# Altium project BTB.PrjPcb
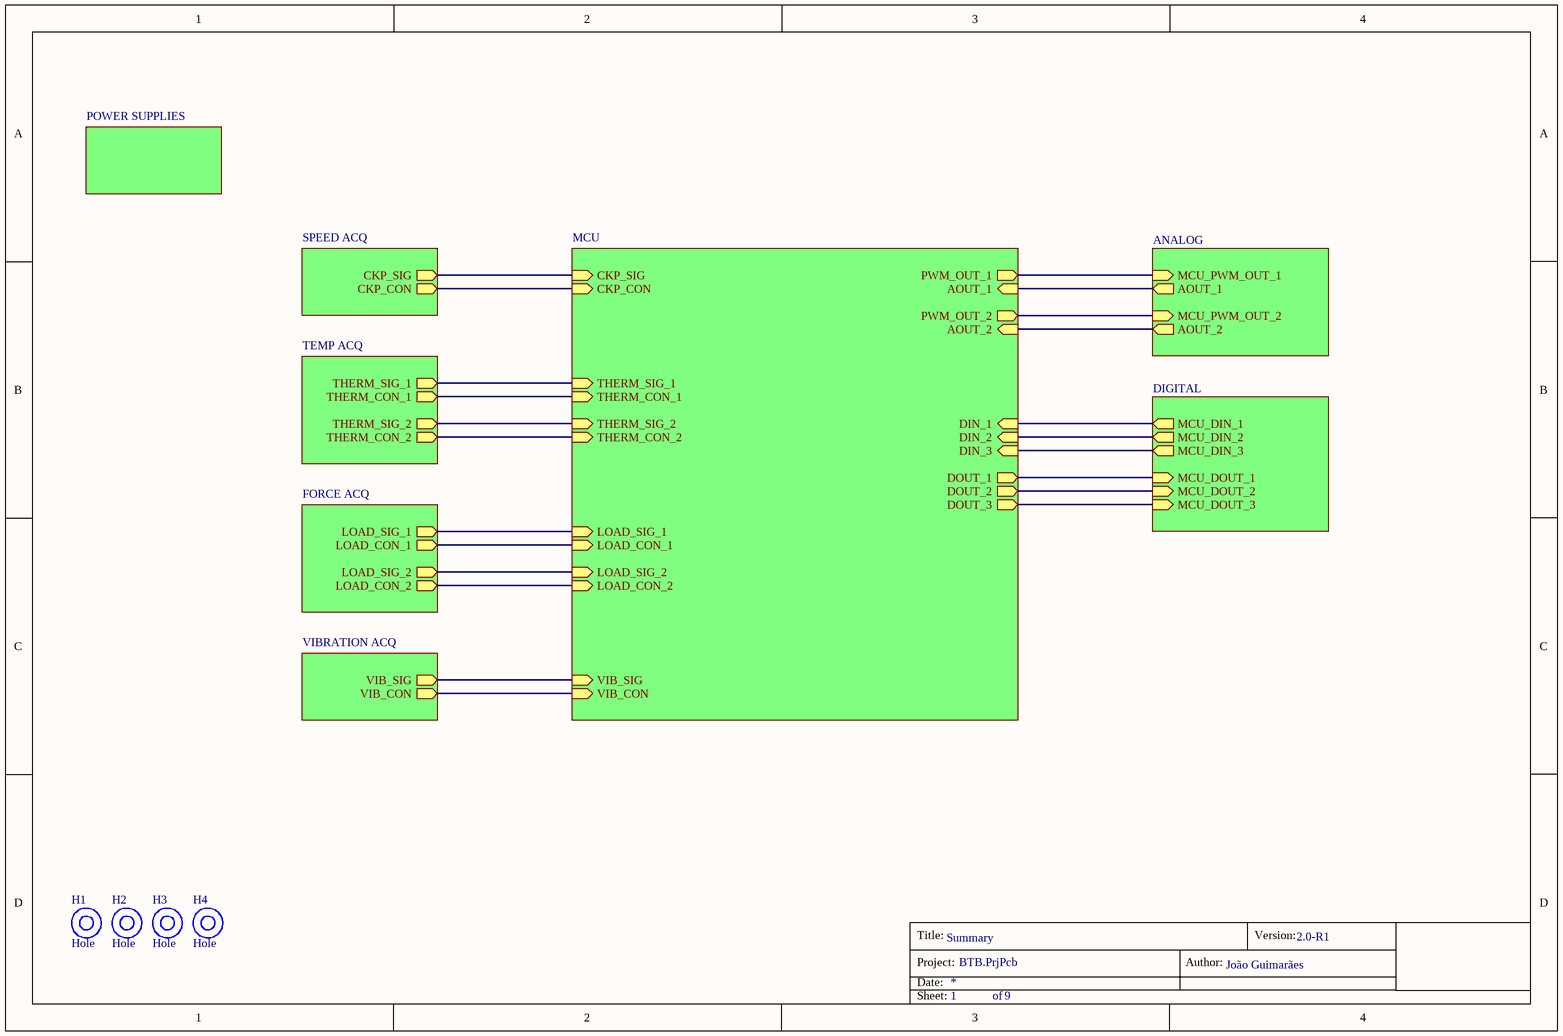
[diagram p0: Summary.SchDoc]
Version: 2.0-R1
9 sheets, 309 parts. Net scope: hierarchical (ports join the sheet entries above them; power ports are global).
Board file: PCB.PcbDoc
Sheets:
  Summary.SchDoc
    SPEED ACQ = SpeedACQ.SchDoc
    MCU = MCU.SchDoc
    TEMP ACQ = TemperatureACQ.SchDoc
    FORCE ACQ = ForceACQ.SchDoc
    VIBRATION ACQ = VibrationACQ.SchDoc
    ANALOG = AnalogOutput.SchDoc
    DIGITAL = DigitalInterfaces.SchDoc
    POWER SUPPLIES = PowerSupplies.SchDoc

## Sheet Summary.SchDoc: Summary
size A4; Author: João Guimarães; Revision: 2.0; SheetNumber: 1; SheetTotal: 9

### Parts
H1  Hole  [MISC-HOLE-3.5MM/6.6MM]
H2  Hole  [MISC-HOLE-3.5MM/6.6MM]
H3  Hole  [MISC-HOLE-3.5MM/6.6MM]
H4  Hole  [MISC-HOLE-3.5MM/6.6MM]

### Sub-sheets
ANALOG = AnalogOutput.SchDoc: MCU_PWM_OUT_1 (in), AOUT_1 (out), MCU_PWM_OUT_2 (in), AOUT_2 (out)
DIGITAL = DigitalInterfaces.SchDoc: MCU_DIN_1 (out), MCU_DIN_2 (out), MCU_DIN_3 (out), MCU_DOUT_1 (in), MCU_DOUT_2 (in), MCU_DOUT_3 (in)
FORCE ACQ = ForceACQ.SchDoc: LOAD_SIG_1 (out), LOAD_CON_1 (out), LOAD_SIG_2 (out), LOAD_CON_2 (out)
MCU = MCU.SchDoc: CKP_SIG (in), CKP_CON (in), THERM_SIG_1 (in), THERM_CON_1 (in), THERM_SIG_2 (in), THERM_CON_2 (in), LOAD_SIG_1 (in), LOAD_CON_1 (in), LOAD_SIG_2 (in), LOAD_CON_2 (in), VIB_SIG (in), VIB_CON (in), DIN_1 (in), DIN_2 (in), DIN_3 (in), DOUT_1 (out), DOUT_2 (out), DOUT_3 (out), PWM_OUT_1 (out), AOUT_1 (in), AOUT_2 (in), PWM_OUT_2 (out)
POWER SUPPLIES = PowerSupplies.SchDoc: no entries
SPEED ACQ = SpeedACQ.SchDoc: CKP_SIG (out), CKP_CON (out)
TEMP ACQ = TemperatureACQ.SchDoc: THERM_SIG_1 (out), THERM_CON_1 (out), THERM_SIG_2 (out), THERM_CON_2 (out)
VIBRATION ACQ = VibrationACQ.SchDoc: VIB_SIG (out), VIB_CON (out)

### Nets
ANALOG_OUT_1: sheet MCU/AOUT_1, sheet ANALOG/AOUT_1
ANALOG_OUT_2: sheet MCU/AOUT_2, sheet ANALOG/AOUT_2
LOAD_CON_1: sheet MCU/LOAD_CON_1, sheet FORCE ACQ/LOAD_CON_1
LOAD_CON_2: sheet MCU/LOAD_CON_2, sheet FORCE ACQ/LOAD_CON_2
LOAD_SIG_1: sheet MCU/LOAD_SIG_1, sheet FORCE ACQ/LOAD_SIG_1
LOAD_SIG_2: sheet MCU/LOAD_SIG_2, sheet FORCE ACQ/LOAD_SIG_2
MISO: sheet MCU/DIN_2, sheet DIGITAL/MCU_DIN_2
MOSI: sheet MCU/DIN_3, sheet DIGITAL/MCU_DIN_3
THERM_CON_1: sheet MCU/THERM_CON_1, sheet TEMP ACQ/THERM_CON_1
THERM_CON_2: sheet MCU/THERM_CON_2, sheet TEMP ACQ/THERM_CON_2
THERM_SIG_1: sheet MCU/THERM_SIG_1, sheet TEMP ACQ/THERM_SIG_1
THERM_SIG_2: sheet MCU/THERM_SIG_2, sheet TEMP ACQ/THERM_SIG_2
NetC43_2: sheet SPEED ACQ/CKP_SIG, sheet MCU/CKP_SIG
NetP22_2: sheet MCU/VIB_SIG, sheet VIBRATION ACQ/VIB_SIG
NetQ4_2: sheet MCU/DIN_1, sheet DIGITAL/MCU_DIN_1
NetQ18_2: sheet SPEED ACQ/CKP_CON, sheet MCU/CKP_CON
NetQ21_2: sheet MCU/VIB_CON, sheet VIBRATION ACQ/VIB_CON
NetR2_2: sheet MCU/PWM_OUT_1, sheet ANALOG/MCU_PWM_OUT_1
NetR8_2: sheet MCU/PWM_OUT_2, sheet ANALOG/MCU_PWM_OUT_2
NetR17_2: sheet MCU/DOUT_1, sheet DIGITAL/MCU_DOUT_1
NetR18_2: sheet MCU/DOUT_2, sheet DIGITAL/MCU_DOUT_2
NetR19_2: sheet MCU/DOUT_3, sheet DIGITAL/MCU_DOUT_3

### Notes on the sheet
- Title:
- Project:
- Date:
- Author:
- Version:
- Sheet:
- of

## Sheet SpeedACQ.SchDoc: SpeedACQ
size A4; Author: João Guimarães; Organization: Altium Limited; Address1: L3, 12a Rodborough Rd; Address2: Frenchs Forest; Address3: NSW; Address4: Australia 2086; Revision: 2.0; SheetNumber: 4; SheetTotal: 9
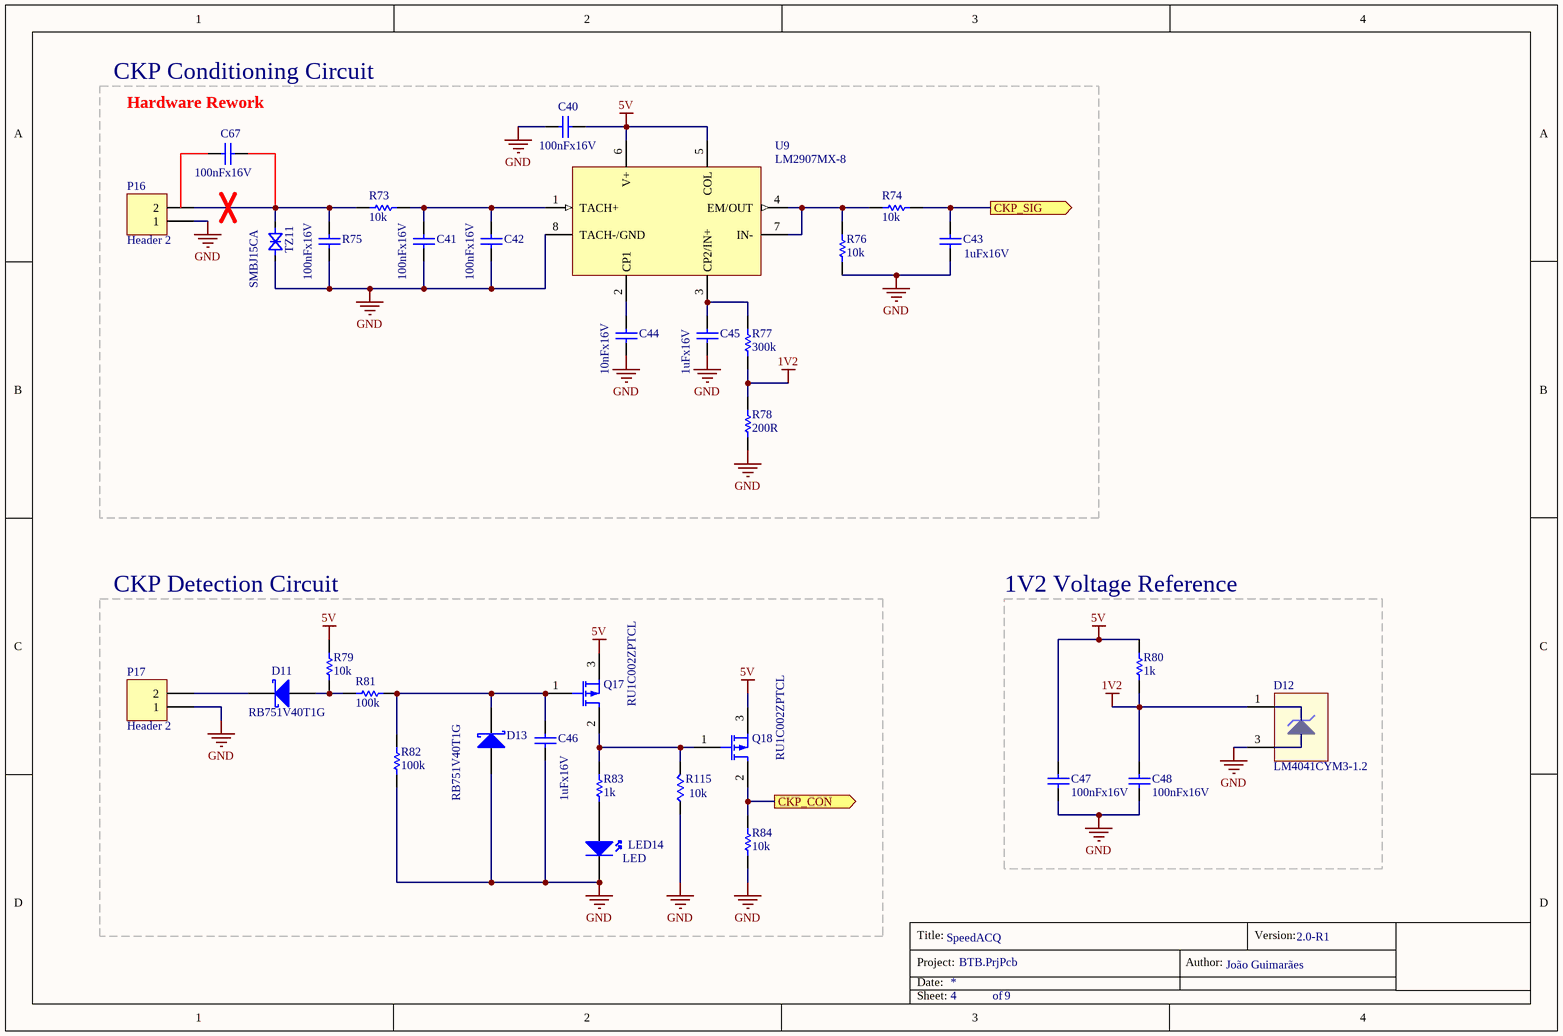
[diagram p1: SpeedACQ.SchDoc]

### Parts
C40  100nFx16V  [DISC-0805]
C41  100nFx16V  [DISC-0805]
C42  100nFx16V  [DISC-0805]
C43  1uFx16V  [DISC-0805]
C44  10nFx16V  [DISC-0805]
C45  1uFx16V  [DISC-0805]
C46  1uFx16V  [DISC-0805]
C47  100nFx16V  [DISC-0805]
C48  100nFx16V  [DISC-0805]
C67  100nFx16V  [DISC-0805]
D11  RB751V40T1G  [DISC-SOD-323]
D12  LM4041CYM3-1.2  [DISC-SOT-23]
D13  RB751V40T1G  [DISC-SOD-323]
LED14  LED  [DISC-LED-0.1-PTH]
P16  Header 2  [CON-FLEXWIRE-0.5MM2-1X2]
P17  Header 2  [CON-FLEXWIRE-0.5MM2-1X2]
Q17  RU1C002ZPTCL  [DISC-SOT-23]
Q18  RU1C002ZPTCL  [DISC-SOT-23]
R73  10k  [DISC-0805]
R74  10k  [DISC-0805]
R75  100nFx16V  [DISC-0805]
R76  10k  [DISC-0805]
R77  300k  [DISC-0805]
R78  200R  [DISC-0805]
R79  10k  [DISC-0805]
R80  1k  [DISC-0805]
R81  100k  [DISC-0805]
R82  100k  [DISC-0805]
R83  1k  [DISC-0805]
R84  10k  [DISC-0805]
R115  10k  [DISC-0805]
TZ11  SMBJ15CA  [DISC-DO214-AA]
U9  LM2907MX-8  [CI-SOIC-8]

### Blocks framed on the sheet
CKP Conditioning Circuit: C40-C45 C67 P16 R73-R78 TZ11 U9
CKP Detection Circuit: C46 D11 D13 LED14 P17 Q17 Q18 R79 R81-R84 R115
1V2 Voltage Reference: C47 C48 D12 R80

### Ports
CKP_CON (out), CKP_SIG (out)

### Nets
1V2: C48.1 D12.1(A) R77.2 R78.1 R80.2
5V: C40.1 C47.1 Q17.3(S) Q18.3(S) R79.1 R80.1 U9.5(COL) U9.6(V+)
GND: C40.2 C41.1 C42.1 C43.1 C44.1 C45.1 C46.1 C47.2 C48.2 D12.3(K) D13.1(A) LED14.2(K) P16.1 P17.1 R75.1 R76.2 R78.2 R82.1 R84.2 R115.1 TZ11.1(A) U9.8(TACH-/GND)
NetC41_2: C41.2 C42.2 R73.1 U9.1(TACH+)
NetC43_2: C43.2 R74.2 ; port CKP_SIG
NetC44_2: C44.2 U9.2(CP1)
NetC45_2: C45.2 R77.1 U9.3(CP2/IN+)
NetC46_2: C46.2 D13.2(K) Q17.1(G) R81.1 R82.2
NetC67_2: C67.2 P16.2 R73.2 R75.2 TZ11.2(K)
NetD11_1: D11.1(A) R79.2 R81.2
NetD11_2: D11.2(K) P17.2
NetLED14_1: LED14.1(A) R83.1
NetQ17_2: Q17.2(D) Q18.1(G) R83.2 R115.2
NetQ18_2: Q18.2(D) R84.1 ; port CKP_CON
NetR74_1: R74.1 R76.1 U9.4(EM/OUT) U9.7(IN-)

Not connected (* = marked no-connect by the designer): C67 1; D12 2

### Notes on the sheet
- (near C67) Hardware Rework
- Title:
- Project:
- Date:
- Author:
- Version:
- Sheet:
- of

### Library data of the parts
C40-C48 C67 R75 = Cap: Capacitor
D11 D13 = D Schottky: Schottky Diode; Published: 8-Jun-2000; LatestRevisionDate: 17-Jul-2002; LatestRevisionNote: Re-released for DXP Platform.; PackageReference: SMB; Publisher: Altium Limited; PackageDescription: DO-214-AA/SMB; 2 C-Bend Leads; Body 5.3 x 3.6 mm, inc. leads (LxW); Code_JEDEC: DO-214-AA
D12 = LM4040: Shunt Voltage References
P16 P17 = Header 2: Header, 2-Pin; LatestRevisionDate: 17-Jul-2002; LatestRevisionNote: Re-released for DXP Platform.; Publisher: Altium Limited
Q17 Q18 = Transistor-PMOS: P-Channel MOSFET
R73 R74 R76-R84 = Res: Resistor
R115 = RESISTOR: PartNumber1: *; Manufacturer1: *; ClassName: *; Price: *; PriceType: FOB
TZ11 = TVZ-Bi-Directional
U9 = LM2907MX-8: Voltage to Frequency & Frequency to Voltage Frequency to Voltage Converter

## Sheet MCU.SchDoc: MCU
size A4; Author: João Guimarães; Revision: 2.0; SheetNumber: 3; SheetTotal: 9
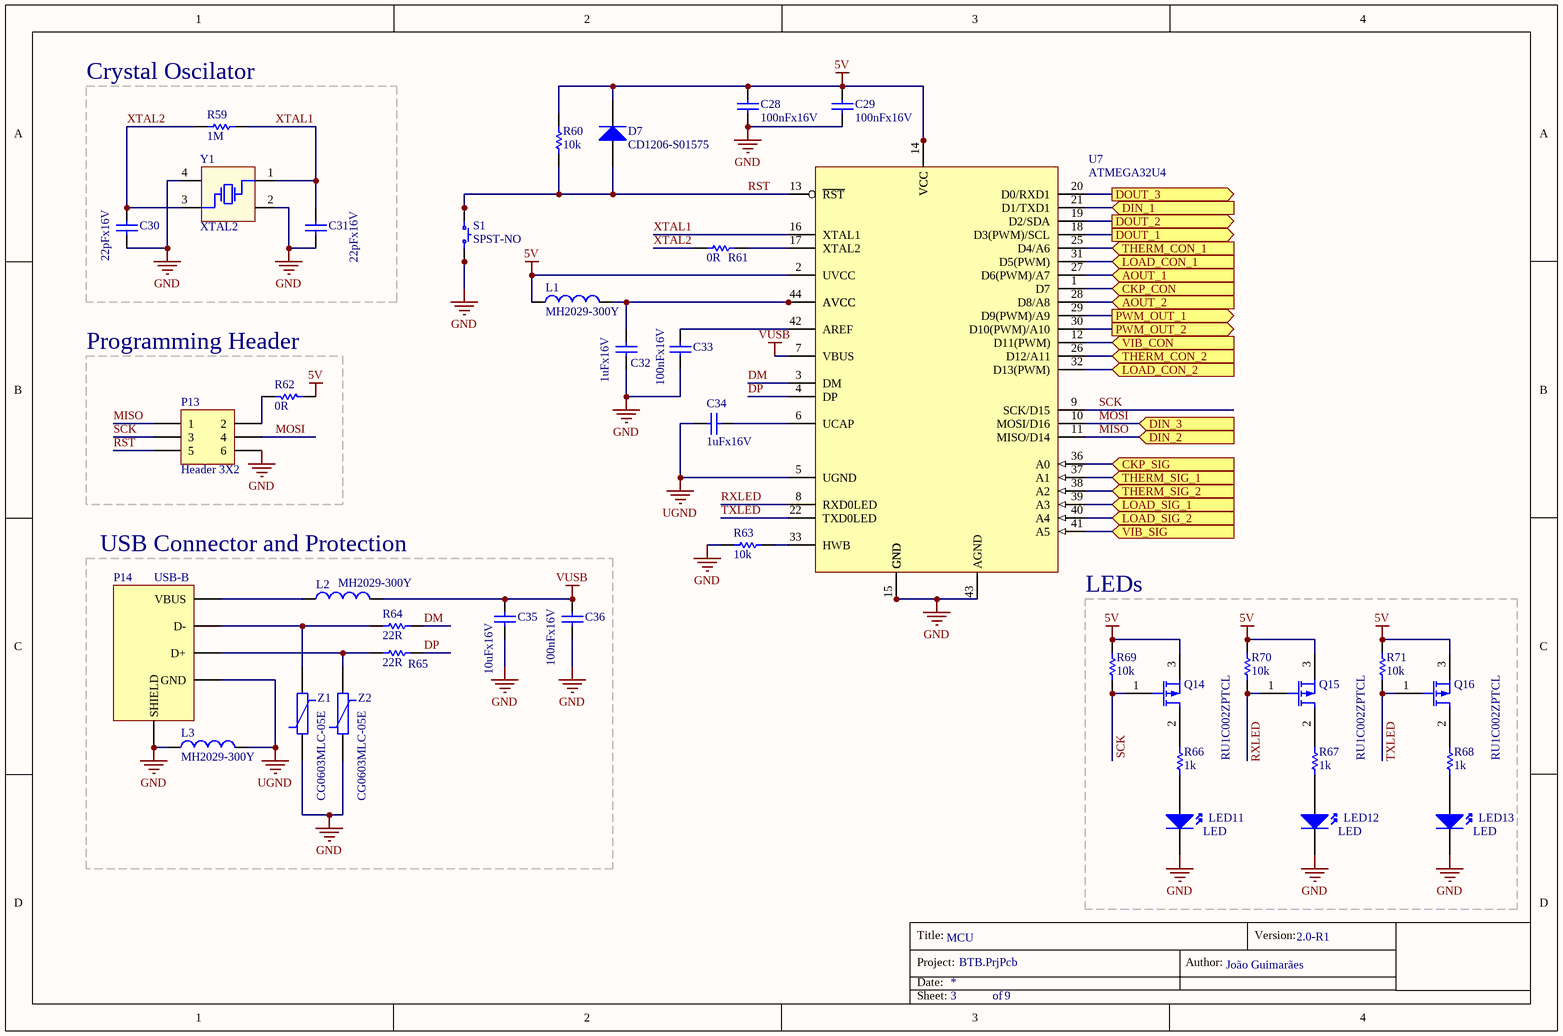
[diagram p2: MCU.SchDoc]

### Parts
C28  100nFx16V  [DISC-0805]
C29  100nFx16V  [DISC-0805]
C30  22pFx16V  [DISC-0805]
C31  22pFx16V  [DISC-0805]
C32  1uFx16V  [DISC-0805]
C33  100nFx16V  [DISC-0805]
C34  1uFx16V  [DISC-0805]
C35  10uFx16V  [DISC-0805]
C36  100nFx16V  [DISC-0805]
D7  CD1206-S01575  [DISC-1206]
L1  MH2029-300Y  [DISC-0805]
L2  MH2029-300Y  [DISC-0805]
L3  MH2029-300Y  [DISC-0805]
LED11  LED  [DISC-LED-0.1-PTH]
LED12  LED  [DISC-LED-0.1-PTH]
LED13  LED  [DISC-LED-0.1-PTH]
P13  Header 3X2  [CON-HEADER-2X3-PTH]
P14  USB-B  [CON-USB-B]
Q14  RU1C002ZPTCL  [DISC-SOT-23]
Q15  RU1C002ZPTCL  [DISC-SOT-23]
Q16  RU1C002ZPTCL  [DISC-SOT-23]
R59  1M  [DISC-0805]
R60  10k  [DISC-0805]
R61  0R  [DISC-0805]
R62  0R  [DISC-0805]
R63  10k  [DISC-0805]
R64  22R  [DISC-0805]
R65  22R  [DISC-0805]
R66  1k  [DISC-0805]
R67  1k  [DISC-0805]
R68  1k  [DISC-0805]
R69  10k  [DISC-0805]
R70  10k  [DISC-0805]
R71  10k  [DISC-0805]
S1  SPST-NO  [DISC-PUSHBUTTON-4P-SMD]
U7  ATMEGA32U4  [CI-QFP-44]
Y1  XTAL2  [DISC-CRYSTAL-4P-3.2X2.5]
Z1  CG0603MLC-05E  [DISC-0603]
Z2  CG0603MLC-05E  [DISC-0603]

### Blocks framed on the sheet
Crystal Oscilator: C30 C31 R59 Y1
Programming Header: P13 R62
USB Connector and Protection: C35 C36 L2 L3 P14 R64 R65 Z1 Z2
LEDs: LED11-LED13 Q14-Q16 R66-R71

### Ports
AOUT_1 (in), AOUT_2 (in), CKP_CON (in), CKP_SIG (in), DIN_1 (in), DIN_2 (in), DIN_3 (in), DOUT_1 (out), DOUT_2 (out), DOUT_3 (out), LOAD_CON_1 (in), LOAD_CON_2 (in), LOAD_SIG_1 (in), LOAD_SIG_2 (in), PWM_OUT_1 (out), PWM_OUT_2 (out), THERM_CON_1 (in), THERM_CON_2 (in), THERM_SIG_1 (in), THERM_SIG_2 (in), VIB_CON (in), VIB_SIG (in)

### Nets
5V: C28.1 C29.1 D7.2(K) L1.1 Q14.3(S) Q15.3(S) Q16.3(S) R60.1 R62.2 R69.1 R70.1 R71.1 U7.2(UVCC) U7.14(VCC) U7.34(VCC)
GND: C28.2 C29.2 C30.1 C31.1 C32.2 C33.2 C35.2 C36.2 L3.1 LED11.2(K) LED12.2(K) LED13.2(K) P13.6 P14.5(SHIELD) P14.6(SHIELD) R63.1 S1.1 S1.2 U7.15(GND) U7.23(GND) U7.35(GND) U7.43(AGND) Y1.2(GND) Y1.4(GND) Z1.1 Z2.1
UGND: C34.1 L3.2 P14.4(GND) U7.5(UGND)
VUSB: C35.1 C36.1 L2.2 U7.7(VBUS)
ANALOG_OUT_1: U7.27(D6(PWM)/A7) ; port AOUT_1
ANALOG_OUT_2: U7.28(D8/A8) ; port AOUT_2
DM: R64.2 U7.3(DM)
DP: R65.2 U7.4(DP)
LOAD_CON_1: U7.31(D5(PWM)) ; port LOAD_CON_1
LOAD_CON_2: U7.32(D13(PWM)) ; port LOAD_CON_2
LOAD_SIG_1: U7.39(A3) ; port LOAD_SIG_1
LOAD_SIG_2: U7.40(A4) ; port LOAD_SIG_2
MISO: P13.1 U7.11(MISO/D14) ; port DIN_2
MOSI: P13.4 U7.10(MOSI/D16) ; port DIN_3
RST: D7.1(A) P13.5 R60.2 S1.3 S1.4 U7.13(~{RST})
RXLED: Q15.1(G) R70.2 U7.8(RXD0LED)
SCK: P13.3 Q14.1(G) R69.2 U7.9(SCK/D15)
THERM_CON_1: U7.25(D4/A6) ; port THERM_CON_1
THERM_CON_2: U7.26(D12/A11) ; port THERM_CON_2
THERM_SIG_1: U7.37(A1) ; port THERM_SIG_1
THERM_SIG_2: U7.38(A2) ; port THERM_SIG_2
TXLED: Q16.1(G) R71.2 U7.22(TXD0LED)
XTAL1: C31.2 R59.2 U7.16(XTAL1) Y1.1(OSC1)
XTAL2: C30.2 R59.1 R61.1 Y1.3(OSC2)
NetC32_1: C32.1 L1.2 U7.24(AVCC) U7.44(AVCC)
NetC33_1: C33.1 U7.42(AREF)
NetC34_2: C34.2 U7.6(UCAP)
NetC43_2: U7.36(A0) ; port CKP_SIG
NetL2_1: L2.1 P14.1(VBUS)
NetLED11_1: LED11.1(A) R66.2
NetLED12_1: LED12.1(A) R67.2
NetLED13_1: LED13.1(A) R68.2
NetP13_2: P13.2 R62.1
NetP14_2: P14.2(D-) R64.1 Z1.2
NetP14_3: P14.3(D+) R65.1 Z2.2
NetP22_2: U7.41(A5) ; port VIB_SIG
NetQ4_2: U7.21(D1/TXD1) ; port DIN_1
NetQ14_2: Q14.2(D) R66.1
NetQ15_2: Q15.2(D) R67.1
NetQ16_2: Q16.2(D) R68.1
NetQ18_2: U7.1(D7) ; port CKP_CON
NetQ21_2: U7.12(D11(PWM)) ; port VIB_CON
NetR2_2: U7.29(D9(PWM)/A9) ; port PWM_OUT_1
NetR8_2: U7.30(D10(PWM)/A10) ; port PWM_OUT_2
NetR17_2: U7.18(D3(PWM)/SCL) ; port DOUT_1
NetR18_2: U7.19(D2/SDA) ; port DOUT_2
NetR19_2: U7.20(D0/RXD1) ; port DOUT_3
NetR61_2: R61.2 U7.17(XTAL2)
NetR63_2: R63.2 U7.33(HWB)

### Notes on the sheet
- Title:
- Project:
- Date:
- Author:
- Version:
- Sheet:
- of

### Library data of the parts
C28-C36 = Cap: Capacitor
D7 = Diode: Default Diode; Published: 8-Jun-2000; LatestRevisionDate: 17-Jul-2002; LatestRevisionNote: Re-released for DXP Platform.; PackageVersion: Sep-1996; PackageReference: SMC; Publisher: Altium Limited; PackageDescription: DO-214-AB/SMC; 2 C-Bend Leads; Body 7.9 x 5.9 mm, inc. leads (LxW); Code_JEDEC: DO-214-AB
L1-L3 = Inductor: Chip Inductor
P13 = Header 3X2: Header, 3-Pin, Dual row; LatestRevisionDate: 17-Jul-2002; LatestRevisionNote: Re-released for DXP Platform.; Publisher: Altium Limited
P14 = USB Type-B
Q14-Q16 = Transistor-PMOS: P-Channel MOSFET
R59-R71 = Res: Resistor
U7 = ATMEGA32U4-AU: 8-bit Microcontroller with 16/32K bytes of ISP Flash and  USB Controller
Y1 = XTAL-4-PIN
Z1 Z2 = Varistor

## Sheet TemperatureACQ.SchDoc: TemperatureACQ
size A4; Author: João Guimarães; Organization: Altium Limited; Address1: L3, 12a Rodborough Rd; Address2: Frenchs Forest; Address3: NSW; Address4: Australia 2086; Revision: 2.0; SheetNumber: 7; SheetTotal: 9
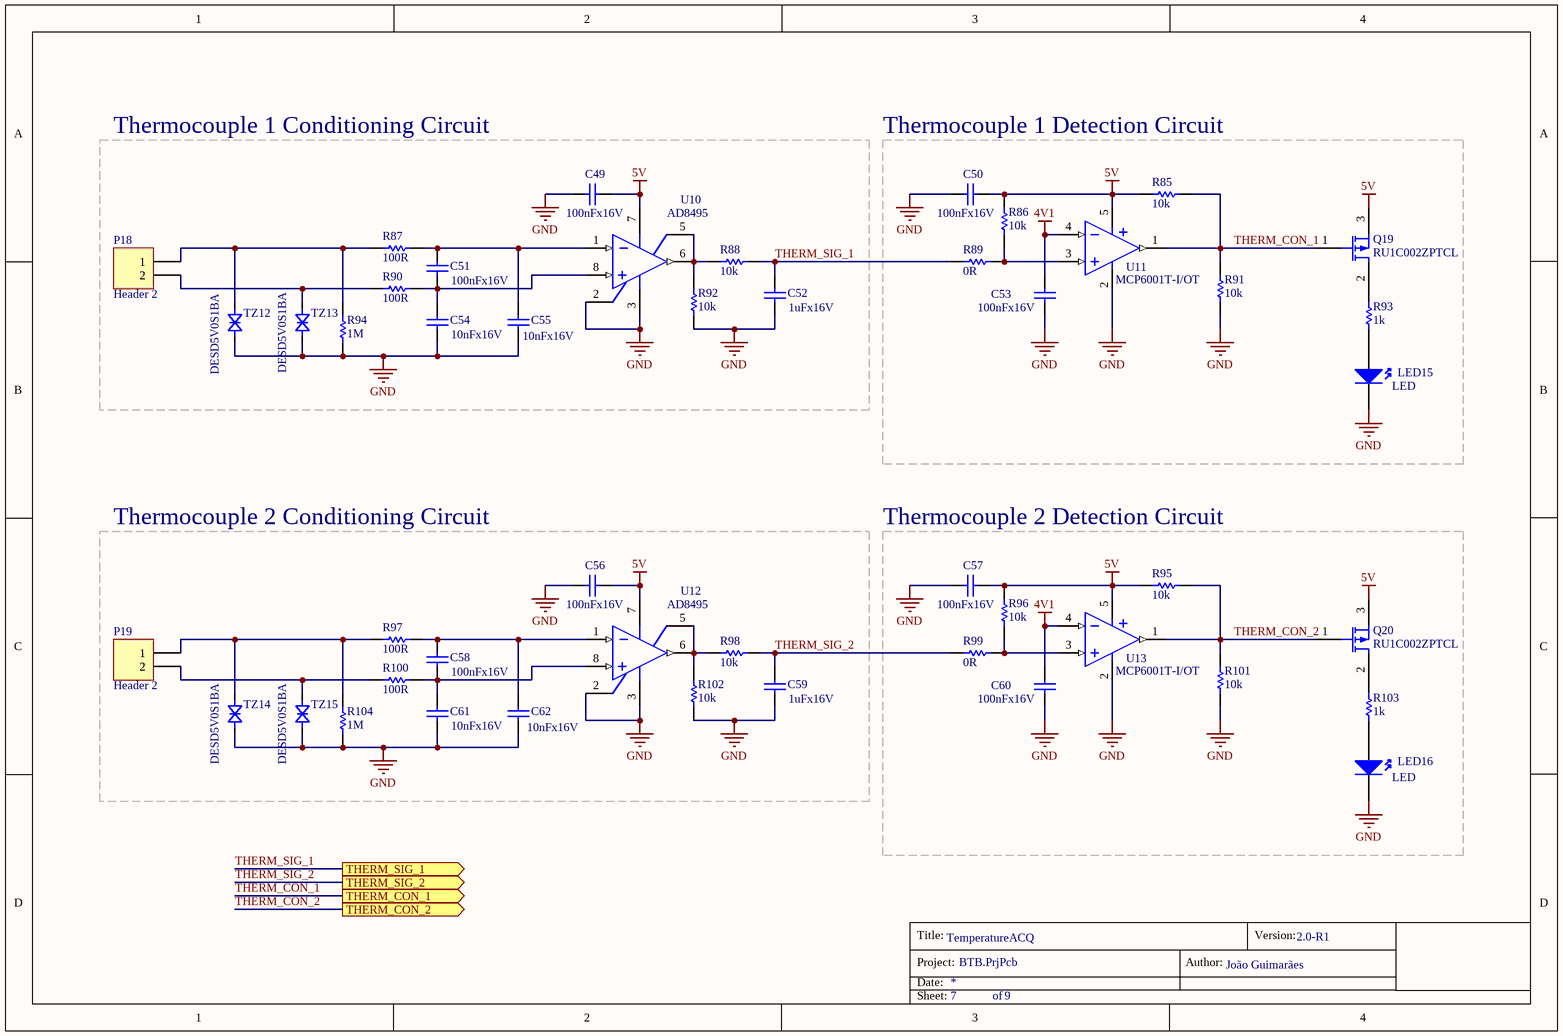
[diagram p3: TemperatureACQ.SchDoc]

### Parts
C49  100nFx16V  [DISC-0805]
C50  100nFx16V  [DISC-0805]
C51  100nFx16V  [DISC-0805]
C52  1uFx16V  [DISC-0805]
C53  100nFx16V  [DISC-0805]
C54  10nFx16V  [DISC-0805]
C55  10nFx16V  [DISC-0805]
C56  100nFx16V  [DISC-0805]
C57  100nFx16V  [DISC-0805]
C58  100nFx16V  [DISC-0805]
C59  1uFx16V  [DISC-0805]
C60  100nFx16V  [DISC-0805]
C61  10nFx16V  [DISC-0805]
C62  10nFx16V  [DISC-0805]
LED15  LED  [DISC-LED-0.1-PTH]
LED16  LED  [DISC-LED-0.1-PTH]
P18  Header 2  [CON-FLEXWIRE-0.5MM2-1X2]
P19  Header 2  [CON-FLEXWIRE-0.5MM2-1X2]
Q19  RU1C002ZPTCL  [DISC-SOT-23]
Q20  RU1C002ZPTCL  [DISC-SOT-23]
R85  10k  [DISC-0805]
R86  10k  [DISC-0805]
R87  100R  [DISC-0805]
R88  10k  [DISC-0805]
R89  0R  [DISC-0805]
R90  100R  [DISC-0805]
R91  10k  [DISC-0805]
R92  10k  [DISC-0805]
R93  1k  [DISC-0805]
R94  1M  [DISC-0805]
R95  10k  [DISC-0805]
R96  10k  [DISC-0805]
R97  100R  [DISC-0805]
R98  10k  [DISC-0805]
R99  0R  [DISC-0805]
R100  100R  [DISC-0805]
R101  10k  [DISC-0805]
R102  10k  [DISC-0805]
R103  1k  [DISC-0805]
R104  1M  [DISC-0805]
TZ12  DESD5V0S1BA  [DISC-SOD-323]
TZ13  DESD5V0S1BA  [DISC-SOD-323]
TZ14  DESD5V0S1BA  [DISC-SOD-323]
TZ15  DESD5V0S1BA  [DISC-SOD-323]
U10  AD8495  [CI-MSOP-8]
U11  MCP6001T-I/OT  [CI-SOT-23-5]
U12  AD8495  [CI-MSOP-8]
U13  MCP6001T-I/OT  [CI-SOT-23-5]

### Blocks framed on the sheet
Thermocouple 1 Conditioning Circuit: C49 C51 C52 C54 C55 P18 R87 R88 R90 R92 R94 TZ12 TZ13 U10
Thermocouple 1 Detection Circuit: C50 C53 LED15 Q19 R85 R86 R89 R91 R93 U11
Thermocouple 2 Conditioning Circuit: C56 C58 C59 C61 C62 P19 R97 R98 R100 R102 R104 TZ14 TZ15 U12
Thermocouple 2 Detection Circuit: C57 C60 LED16 Q20 R95 R96 R99 R101 R103 U13

### Ports
THERM_CON_1 (out), THERM_CON_2 (out), THERM_SIG_1 (out), THERM_SIG_2 (out)

### Nets
4V1: C53.2 C60.2 U11.4(IN-) U13.4(IN-)
5V: C49.1 C50.2 C56.1 C57.2 Q19.3(S) Q20.3(S) R85.1 R86.1 R95.1 R96.1 U10.7(V+) U11.5(V+) U12.7(V+) U13.5(V+)
GND: C49.2 C50.1 C52.1 C53.1 C54.1 C55.1 C56.2 C57.1 C59.1 C60.1 C61.1 C62.1 LED15.2(K) LED16.2(K) R91.2 R92.2 R94.1 R101.2 R102.2 R104.1 TZ12.1(A) TZ13.1(A) TZ14.1(A) TZ15.1(A) U10.2(REF) U10.3(V-) U11.2(V-) U12.2(REF) U12.3(V-) U13.2(V-)
THERM_CON_1: Q19.1(G) R85.2 R91.1 U11.1(Out) ; port THERM_CON_1
THERM_CON_2: Q20.1(G) R95.2 R101.1 U13.1(Out) ; port THERM_CON_2
THERM_SIG_1: C52.2 R88.2 R89.1 ; port THERM_SIG_1
THERM_SIG_2: C59.2 R98.2 R99.1 ; port THERM_SIG_2
NetC51_1: C51.1 C54.2 R90.1 U10.8(IN+)
NetC51_2: C51.2 C55.2 R87.1 U10.1(IN-)
NetC58_1: C58.1 C61.2 R100.1 U12.8(IN+)
NetC58_2: C58.2 C62.2 R97.1 U12.1(IN-)
NetLED15_1: LED15.1(A) R93.1
NetLED16_1: LED16.1(A) R103.1
NetP18_1: P18.1 R87.2 R94.2 TZ12.2(K)
NetP18_2: P18.2 R90.2 TZ13.2(K)
NetP19_1: P19.1 R97.2 R104.2 TZ14.2(K)
NetP19_2: P19.2 R100.2 TZ15.2(K)
NetQ19_2: Q19.2(D) R93.2
NetQ20_2: Q20.2(D) R103.2
NetR86_2: R86.2 R89.2 U11.3(IN+)
NetR88_1: R88.1 R92.1 U10.5(SENSE) U10.6(OUT)
NetR96_2: R96.2 R99.2 U13.3(IN+)
NetR98_1: R98.1 R102.1 U12.5(SENSE) U12.6(OUT)

### Notes on the sheet
- Title:
- Project:
- Date:
- Author:
- Version:
- Sheet:
- of

### Library data of the parts
C49-C62 = Cap: Capacitor
P18 P19 = Header 2: Header, 2-Pin; LatestRevisionDate: 17-Jul-2002; LatestRevisionNote: Re-released for DXP Platform.; Publisher: Altium Limited
Q19 Q20 = Transistor-PMOS: P-Channel MOSFET
R85-R104 = Res: Resistor
TZ12-TZ15 = TVZ-Bi-Directional
U10 U12 = AD8495: Precision Type K Thermocouple Amplifier with Cold Junction Compensation
U11 U13 = MCP6001T-I/OT: Operational Amplifiers - Op Amps Single 1.8V 1MHz

## Sheet ForceACQ.SchDoc: ForceACQ
size A4; Author: João Guimarães; Revision: 2.0; SheetNumber: 5; SheetTotal: 9
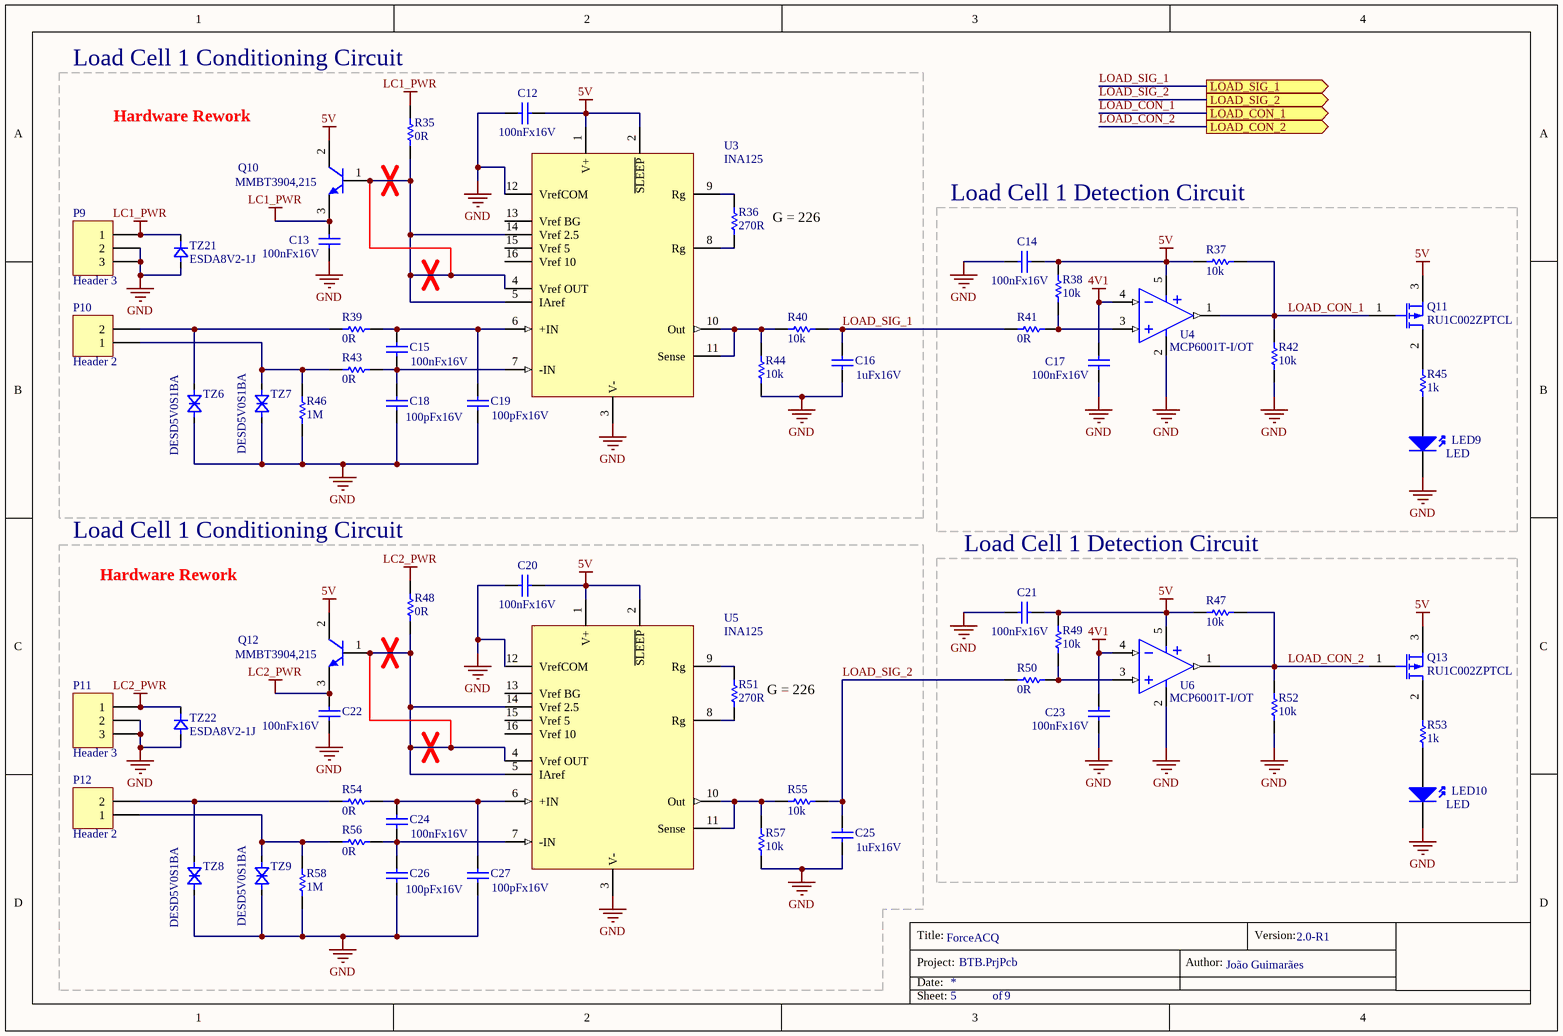
[diagram p4: ForceACQ.SchDoc]

### Parts
C12  100nFx16V  [DISC-0805]
C13  100nFx16V  [DISC-0805]
C14  100nFx16V  [DISC-0805]
C15  100nFx16V  [DISC-0805]
C16  1uFx16V  [DISC-0805]
C17  100nFx16V  [DISC-0805]
C18  100pFx16V  [DISC-0805]
C19  100pFx16V  [DISC-0805]
C20  100nFx16V  [DISC-0805]
C21  100nFx16V  [DISC-0805]
C22  100nFx16V  [DISC-0805]
C23  100nFx16V  [DISC-0805]
C24  100nFx16V  [DISC-0805]
C25  1uFx16V  [DISC-0805]
C26  100pFx16V  [DISC-0805]
C27  100pFx16V  [DISC-0805]
LED9  LED  [DISC-LED-0.1-PTH]
LED10  LED  [DISC-LED-0.1-PTH]
P9  Header 3  [CON-FLEXWIRE-0.5MM2-1X3]
P10  Header 2  [CON-FLEXWIRE-0.5MM2-1X2]
P11  Header 3  [CON-FLEXWIRE-0.5MM2-1X3]
P12  Header 2  [CON-FLEXWIRE-0.5MM2-1X2]
Q10  MMBT3904,215  [DISC-SOT-23]
Q11  RU1C002ZPTCL  [DISC-SOT-23]
Q12  MMBT3904,215  [DISC-SOT-23]
Q13  RU1C002ZPTCL  [DISC-SOT-23]
R35  0R  [DISC-0805]
R36  270R  [DISC-0805]
R37  10k  [DISC-0805]
R38  10k  [DISC-0805]
R39  0R  [DISC-0805]
R40  10k  [DISC-0805]
R41  0R  [DISC-0805]
R42  10k  [DISC-0805]
R43  0R  [DISC-0805]
R44  10k  [DISC-0805]
R45  1k  [DISC-0805]
R46  1M  [DISC-0805]
R47  10k  [DISC-0805]
R48  0R  [DISC-0805]
R49  10k  [DISC-0805]
R50  0R  [DISC-0805]
R51  270R  [DISC-0805]
R52  10k  [DISC-0805]
R53  1k  [DISC-0805]
R54  0R  [DISC-0805]
R55  10k  [DISC-0805]
R56  0R  [DISC-0805]
R57  10k  [DISC-0805]
R58  1M  [DISC-0805]
TZ6  DESD5V0S1BA  [DISC-SOD-323]
TZ7  DESD5V0S1BA  [DISC-SOD-323]
TZ8  DESD5V0S1BA  [DISC-SOD-323]
TZ9  DESD5V0S1BA  [DISC-SOD-323]
TZ21  ESDA8V2-1J  [DISC-SOD-323]
TZ22  ESDA8V2-1J  [DISC-SOD-323]
U3  INA125  [CI-SOIC-16]
U4  MCP6001T-I/OT  [CI-SOT-23-5]
U5  INA125  [CI-SOIC-16]
U6  MCP6001T-I/OT  [CI-SOT-23-5]

### Blocks framed on the sheet
Load Cell 1 Conditioning Circuit: C12 C13 C15 C16 C18 C19 P9 P10 Q10 R35 R36 R39 R40 R43 R44 R46 TZ6 TZ7 TZ21 U3
Load Cell 1 Detection Circuit: C14 C17 LED9 Q11 R37 R38 R41 R42 R45 U4
Load Cell 1 Conditioning Circuit: C20 C22 C24-C27 P11 P12 Q12 R48 R51 R54-R58 TZ8 TZ9 TZ22 U5
Load Cell 1 Detection Circuit: C21 C23 LED10 Q13 R47 R49 R50 R52 R53 U6

### Ports
LOAD_CON_1 (out), LOAD_CON_2 (out), LOAD_SIG_1 (out), LOAD_SIG_2 (out)

### Nets
4V1: C17.2 C23.2 U4.4(IN-) U6.4(IN-)
5V: C12.1 C14.2 C20.1 C21.2 Q10.2(C) Q11.3(S) Q12.2(C) Q13.3(S) R37.1 R38.1 R47.1 R49.1 U3.1(V+) U3.2(~{SLEEP}) U4.5(V+) U5.1(V+) U5.2(~{SLEEP}) U6.5(V+)
GND: C12.2 C13.1 C14.1 C16.1 C17.1 C18.1 C19.1 C20.2 C21.1 C22.1 C23.1 C25.1 C26.1 C27.1 LED9.2(K) LED10.2(K) P9.2 P9.3 P11.2 P11.3 R42.2 R44.2 R46.1 R52.2 R57.2 R58.1 TZ6.1(A) TZ7.1(A) TZ8.1(A) TZ9.1(A) TZ21.1(A) TZ22.1(A) U3.3(V-) U3.12(VrefCOM) U4.2(V-) U5.3(V-) U5.12(VrefCOM) U6.2(V-)
LC1_PWR: C13.2 P9.1 Q10.3(E) R35.1 TZ21.2(C)
LC2_PWR: C22.2 P11.1 Q12.3(E) R48.1 TZ22.2(C)
LOAD_CON_1: Q11.1(G) R37.2 R42.1 U4.1(Out) ; port LOAD_CON_1
LOAD_CON_2: Q13.1(G) R47.2 R52.1 U6.1(Out) ; port LOAD_CON_2
LOAD_SIG_1: C16.2 R40.2 R41.1 ; port LOAD_SIG_1
LOAD_SIG_2: C25.2 R50.1 R55.2 ; port LOAD_SIG_2
NetC15_1: C15.1 C18.2 R43.1 U3.7(-IN)
NetC15_2: C15.2 C19.2 R39.1 U3.6(+IN)
NetC24_1: C24.1 C26.2 R56.1 U5.7(-IN)
NetC24_2: C24.2 C27.2 R54.1 U5.6(+IN)
NetLED9_1: LED9.1(A) R45.1
NetLED10_1: LED10.1(A) R53.1
NetP10_1: P10.1 R43.2 R46.2 TZ7.2(K)
NetP10_2: P10.2 R39.2 TZ6.2(K)
NetP12_1: P12.1 R56.2 R58.2 TZ9.2(K)
NetP12_2: P12.2 R54.2 TZ8.2(K)
NetQ10_1: Q10.1(B) R35.2 U3.4(Vref_OUT) U3.5(IAref) U3.14(Vref_2.5)
NetQ11_2: Q11.2(D) R45.2
NetQ12_1: Q12.1(B) R48.2 U5.4(Vref_OUT) U5.5(IAref) U5.14(Vref_2.5)
NetQ13_2: Q13.2(D) R53.2
NetR36_1: R36.1 U3.9(Rg)
NetR36_2: R36.2 U3.8(Rg)
NetR38_2: R38.2 R41.2 U4.3(IN+)
NetR40_1: R40.1 R44.1 U3.10(Out) U3.11(Sense)
NetR49_2: R49.2 R50.2 U6.3(IN+)
NetR51_1: R51.1 U5.9(Rg)
NetR51_2: R51.2 U5.8(Rg)
NetR55_1: R55.1 R57.1 U5.10(Out) U5.11(Sense)

Not connected (* = marked no-connect by the designer): U3 13(Vref_BG) 15(Vref_5) 16(Vref_10); U5 13(Vref_BG) 15(Vref_5) 16(Vref_10)

### Notes on the sheet
- Hardware Rework
- (near R36) G = 226
- (near R51) G = 226
- Title:
- Project:
- Date:
- Author:
- Version:
- Sheet:
- of

### Library data of the parts
C12-C27 = Cap: Capacitor
P9 P11 = Header 3: Header, 3-Pin; LatestRevisionDate: 17-Jul-2002; LatestRevisionNote: Re-released for DXP Platform.; Publisher: Altium Limited
P10 P12 = Header 2: Header, 2-Pin; LatestRevisionDate: 17-Jul-2002; LatestRevisionNote: Re-released for DXP Platform.; Publisher: Altium Limited
Q10 Q12 = Transistor-NPN: NPN Bipolar Transistor; Published: 8-Jun-2000; LatestRevisionDate: 17-Jul-2002; LatestRevisionNote: Re-released for DXP Platform.; PackageReference: TO-226-AA; Publisher: Altium Limited; PackageDescription: TO, Flat Index; 3 In-Line, Axial Leads; Body Dia. 4.8mm; Leads 0.55 x 0.51 mm (max); Code_JEDEC: TO-226-AA
Q11 Q13 = Transistor-PMOS: P-Channel MOSFET
R35-R58 = Res: Resistor
TZ6-TZ9 = TVZ-Bi-Directional
TZ21 TZ22 = TVZ-Unidirectional
U3 U5 = INA125P: INSTRUMENTATION AMPLIFIER With Precision Voltage Reference
U4 U6 = MCP6001T-I/OT: as U11 on sheet TemperatureACQ

## Sheet VibrationACQ.SchDoc: VibrationACQ
size A4; Author: João Guimarães; Organization: Altium Limited; Address1: L3, 12a Rodborough Rd; Address2: Frenchs Forest; Address3: NSW; Address4: Australia 2086; Revision: 2.0; SheetNumber: 6; SheetTotal: 9
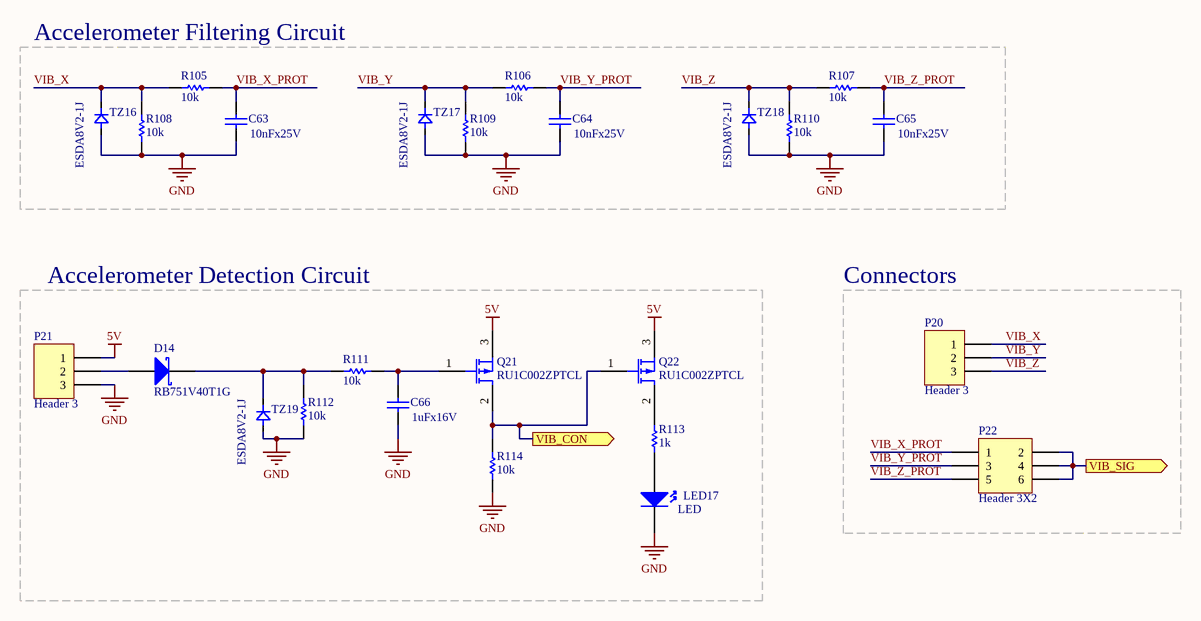
[diagram p5: VibrationACQ.SchDoc]

### Parts
C63  10nFx25V  [DISC-0805]
C64  10nFx25V  [DISC-0805]
C65  10nFx25V  [DISC-0805]
C66  1uFx16V  [DISC-0805]
D14  RB751V40T1G  [DISC-SOD-323]
LED17  LED  [DISC-LED-0.1-PTH]
P20  Header 3  [CON-FLEXWIRE-0.5MM2-1X3]
P21  Header 3  [CON-FLEXWIRE-0.5MM2-1X3]
P22  Header 3X2  [CON-HEADER-2X3-PTH]
Q21  RU1C002ZPTCL  [DISC-SOT-23]
Q22  RU1C002ZPTCL  [DISC-SOT-23]
R105  10k  [DISC-0805]
R106  10k  [DISC-0805]
R107  10k  [DISC-0805]
R108  10k  [DISC-0805]
R109  10k  [DISC-0805]
R110  10k  [DISC-0805]
R111  10k  [DISC-0805]
R112  10k  [DISC-0805]
R113  1k  [DISC-0805]
R114  10k  [DISC-0805]
TZ16  ESDA8V2-1J  [DISC-SOD-323]
TZ17  ESDA8V2-1J  [DISC-SOD-323]
TZ18  ESDA8V2-1J  [DISC-SOD-323]
TZ19  ESDA8V2-1J  [DISC-SOD-323]

### Blocks framed on the sheet
Accelerometer Filtering Circuit: C63-C65 R105-R110 TZ16-TZ18
Accelerometer Detection Circuit: C66 D14 LED17 P21 Q21 Q22 R111-R114 TZ19
Connectors: P20 P22

### Ports
VIB_CON (out), VIB_SIG (out)

### Nets
5V: P21.1 Q21.3(S) Q22.3(S)
GND: C63.1 C64.1 C65.1 C66.1 LED17.2(K) P21.3 R108.2 R109.2 R110.2 R112.2 R114.1 TZ16.1(A) TZ17.1(A) TZ18.1(A) TZ19.1(A)
VIB_X: P20.1 R105.2 R108.1 TZ16.2(C)
VIB_X_PROT: C63.2 P22.1 R105.1
VIB_Y: P20.2 R106.2 R109.1 TZ17.2(C)
VIB_Y_PROT: C64.2 P22.3 R106.1
VIB_Z: P20.3 R107.2 R110.1 TZ18.2(C)
VIB_Z_PROT: C65.2 P22.5 R107.1
NetC66_2: C66.2 Q21.1(G) R111.2
NetD14_1: D14.1(A) P21.2
NetD14_2: D14.2(K) R111.1 R112.1 TZ19.2(C)
NetLED17_1: LED17.1(A) R113.1
NetP22_2: P22.2 P22.4 P22.6 ; port VIB_SIG
NetQ21_2: Q21.2(D) Q22.1(G) R114.2 ; port VIB_CON
NetQ22_2: Q22.2(D) R113.2

### Notes on the sheet
- Title:
- Project:
- Date:
- Author:
- Version:
- Sheet:
- of

### Library data of the parts
C63-C66 = Cap: Capacitor
D14 = D Schottky: Schottky Diode; Published: 8-Jun-2000; LatestRevisionDate: 17-Jul-2002; LatestRevisionNote: Re-released for DXP Platform.; PackageReference: SMB; Publisher: Altium Limited; PackageDescription: DO-214-AA/SMB; 2 C-Bend Leads; Body 5.3 x 3.6 mm, inc. leads (LxW); Code_JEDEC: DO-214-AA
P20 P21 = Header 3: Header, 3-Pin; LatestRevisionDate: 17-Jul-2002; LatestRevisionNote: Re-released for DXP Platform.; Publisher: Altium Limited
P22 = Header 3X2: Header, 3-Pin, Dual row; LatestRevisionDate: 17-Jul-2002; LatestRevisionNote: Re-released for DXP Platform.; Publisher: Altium Limited
Q21 Q22 = Transistor-PMOS: P-Channel MOSFET
R105-R114 = Res: Resistor
TZ16-TZ19 = TVZ-Unidirectional

## Sheet AnalogOutput.SchDoc: Analog Output
size A4; Author: João Guimarães; Revision: 2.0; SheetNumber: 8; SheetTotal: 9
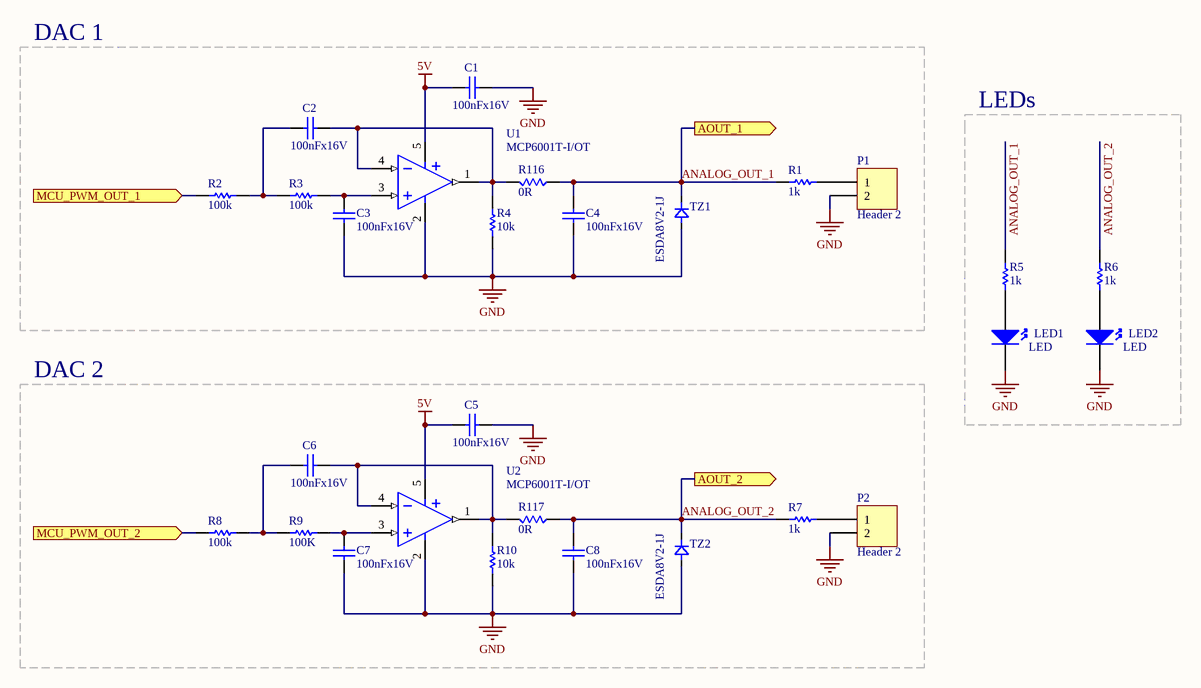
[diagram p6: AnalogOutput.SchDoc]

### Parts
C1  100nFx16V  [DISC-0805]
C2  100nFx16V  [DISC-0805]
C3  100nFx16V  [DISC-0805]
C4  100nFx16V  [DISC-0805]
C5  100nFx16V  [DISC-0805]
C6  100nFx16V  [DISC-0805]
C7  100nFx16V  [DISC-0805]
C8  100nFx16V  [DISC-0805]
LED1  LED  [DISC-LED-0.1-PTH]
LED2  LED  [DISC-LED-0.1-PTH]
P1  Header 2  [CON-FLEXWIRE-0.5MM2-1X2]
P2  Header 2  [CON-FLEXWIRE-0.5MM2-1X2]
R1  1k  [DISC-0805]
R2  100k  [DISC-0805]
R3  100k  [DISC-0805]
R4  10k  [DISC-0805]
R5  1k  [DISC-0805]
R6  1k  [DISC-0805]
R7  1k  [DISC-0805]
R8  100k  [DISC-0805]
R9  100K  [DISC-0805]
R10  10k  [DISC-0805]
R116  0R  [DISC-0805]
R117  0R  [DISC-0805]
TZ1  ESDA8V2-1J  [DISC-SOD-323]
TZ2  ESDA8V2-1J  [DISC-SOD-323]
U1  MCP6001T-I/OT  [CI-SOT-23-5]
U2  MCP6001T-I/OT  [CI-SOT-23-5]

### Blocks framed on the sheet
DAC 1: C1-C4 P1 R1-R4 R116 TZ1 U1
LEDs: LED1 LED2 R5 R6
DAC 2: C5-C8 P2 R7-R10 R117 TZ2 U2

### Ports
AOUT_1 (out), AOUT_2 (out), MCU_PWM_OUT_1 (in), MCU_PWM_OUT_2 (in)

### Nets
5V: C1.2 C5.2 U1.5(V+) U2.5(V+)
GND: C1.1 C3.2 C4.2 C5.1 C7.2 C8.2 LED1.2(K) LED2.2(K) P1.2 P2.2 R4.2 R10.2 TZ1.1(A) TZ2.1(A) U1.2(V-) U2.2(V-)
ANALOG_OUT_1: C4.1 R1.2 R5.2 R116.1 TZ1.2(C) ; port AOUT_1
ANALOG_OUT_2: C8.1 R6.2 R7.2 R117.1 TZ2.2(C) ; port AOUT_2
NetC2_1: C2.1 R4.1 R116.2 U1.1(Out) U1.4(IN-)
NetC2_2: C2.2 R2.1 R3.2
NetC3_1: C3.1 R3.1 U1.3(IN+)
NetC6_1: C6.1 R10.1 R117.2 U2.1(Out) U2.4(IN-)
NetC6_2: C6.2 R8.1 R9.2
NetC7_1: C7.1 R9.1 U2.3(IN+)
NetLED1_1: LED1.1(A) R5.1
NetLED2_1: LED2.1(A) R6.1
NetP1_1: P1.1 R1.1
NetP2_1: P2.1 R7.1
NetR2_2: R2.2 ; port MCU_PWM_OUT_1
NetR8_2: R8.2 ; port MCU_PWM_OUT_2

### Notes on the sheet
- Title:
- Project:
- Date:
- Author:
- Version:
- Sheet:
- of

### Library data of the parts
C1-C8 = Cap: Capacitor
P1 P2 = Header 2: Header, 2-Pin; LatestRevisionDate: 17-Jul-2002; LatestRevisionNote: Re-released for DXP Platform.; Publisher: Altium Limited
R1-R10 = Res: Resistor
R116 R117 = RESISTOR: PartNumber1: *; Manufacturer1: *; ClassName: *; Price: *; PriceType: FOB
TZ1 TZ2 = TVZ-Unidirectional
U1 U2 = MCP6001T-I/OT: as U11 on sheet TemperatureACQ

## Sheet DigitalInterfaces.SchDoc: Digital Interfaces
size A4; Author: João Guimarães; DocumentNumber: 9; Revision: 2.0; DocumentName: 9
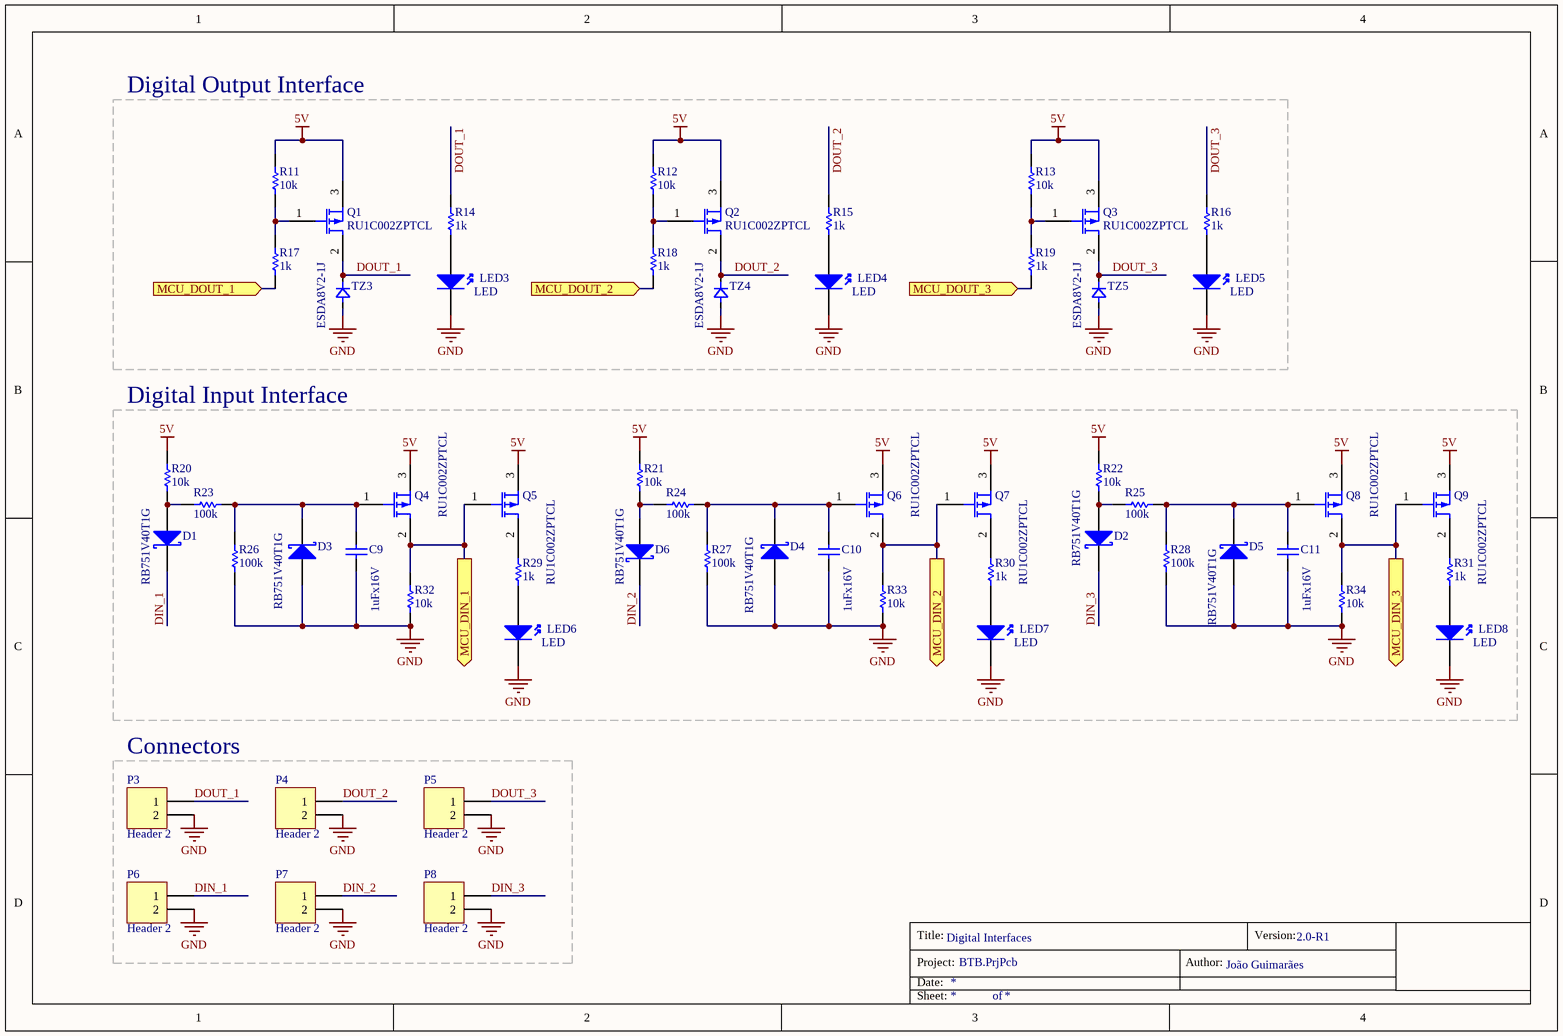
[diagram p7: DigitalInterfaces.SchDoc]

### Parts
C9  1uFx16V  [DISC-0805]
C10  1uFx16V  [DISC-0805]
C11  1uFx16V  [DISC-0805]
D1  RB751V40T1G  [DISC-SOD-323]
D2  RB751V40T1G  [DISC-SOD-323]
D3  RB751V40T1G  [DISC-SOD-323]
D4  RB751V40T1G  [DISC-SOD-323]
D5  RB751V40T1G  [DISC-SOD-323]
D6  RB751V40T1G  [DISC-SOD-323]
LED3  LED  [DISC-LED-0.1-PTH]
LED4  LED  [DISC-LED-0.1-PTH]
LED5  LED  [DISC-LED-0.1-PTH]
LED6  LED  [DISC-LED-0.1-PTH]
LED7  LED  [DISC-LED-0.1-PTH]
LED8  LED  [DISC-LED-0.1-PTH]
P3  Header 2  [CON-FLEXWIRE-0.5MM2-1X2]
P4  Header 2  [CON-FLEXWIRE-0.5MM2-1X2]
P5  Header 2  [CON-FLEXWIRE-0.5MM2-1X2]
P6  Header 2  [CON-FLEXWIRE-0.5MM2-1X2]
P7  Header 2  [CON-FLEXWIRE-0.5MM2-1X2]
P8  Header 2  [CON-FLEXWIRE-0.5MM2-1X2]
Q1  RU1C002ZPTCL  [DISC-SOT-23]
Q2  RU1C002ZPTCL  [DISC-SOT-23]
Q3  RU1C002ZPTCL  [DISC-SOT-23]
Q4  RU1C002ZPTCL  [DISC-SOT-23]
Q5  RU1C002ZPTCL  [DISC-SOT-23]
Q6  RU1C002ZPTCL  [DISC-SOT-23]
Q7  RU1C002ZPTCL  [DISC-SOT-23]
Q8  RU1C002ZPTCL  [DISC-SOT-23]
Q9  RU1C002ZPTCL  [DISC-SOT-23]
R11  10k  [DISC-0805]
R12  10k  [DISC-0805]
R13  10k  [DISC-0805]
R14  1k  [DISC-0805]
R15  1k  [DISC-0805]
R16  1k  [DISC-0805]
R17  1k  [DISC-0805]
R18  1k  [DISC-0805]
R19  1k  [DISC-0805]
R20  10k  [DISC-0805]
R21  10k  [DISC-0805]
R22  10k  [DISC-0805]
R23  100k  [DISC-0805]
R24  100k  [DISC-0805]
R25  100k  [DISC-0805]
R26  100k  [DISC-0805]
R27  100k  [DISC-0805]
R28  100k  [DISC-0805]
R29  1k  [DISC-0805]
R30  1k  [DISC-0805]
R31  1k  [DISC-0805]
R32  10k  [DISC-0805]
R33  10k  [DISC-0805]
R34  10k  [DISC-0805]
TZ3  ESDA8V2-1J  [DISC-SOD-323]
TZ4  ESDA8V2-1J  [DISC-SOD-323]
TZ5  ESDA8V2-1J  [DISC-SOD-323]

### Blocks framed on the sheet
Digital Output Interface: LED3-LED5 Q1-Q3 R11-R19 TZ3-TZ5
Digital Input Interface: C9-C11 D1-D6 LED6-LED8 Q4-Q9 R20-R34
Connectors: P3-P8

### Ports
MCU_DIN_1 (out), MCU_DIN_2 (out), MCU_DIN_3 (out), MCU_DOUT_1 (in), MCU_DOUT_2 (in), MCU_DOUT_3 (in)

### Nets
5V: Q1.3(S) Q2.3(S) Q3.3(S) Q4.3(S) Q5.3(S) Q6.3(S) Q7.3(S) Q8.3(S) Q9.3(S) R11.1 R12.1 R13.1 R20.1 R21.1 R22.1
GND: C9.1 C10.1 C11.1 D3.1(A) D4.1(A) D5.1(A) LED3.2(K) LED4.2(K) LED5.2(K) LED6.2(K) LED7.2(K) LED8.2(K) P3.2 P4.2 P5.2 P6.2 P7.2 P8.2 R26.1 R27.1 R28.1 R32.1 R33.1 R34.1 TZ3.1(A) TZ4.1(A) TZ5.1(A)
DIN_1: D1.2(K) P6.1
DIN_2: D6.2(K) P7.1
DIN_3: D2.2(K) P8.1
DOUT_1: P3.1 Q1.2(D) R14.2 TZ3.2(C)
DOUT_2: P4.1 Q2.2(D) R15.2 TZ4.2(C)
DOUT_3: P5.1 Q3.2(D) R16.2 TZ5.2(C)
MISO: Q6.2(D) Q7.1(G) R33.2 ; port MCU_DIN_2
MOSI: Q8.2(D) Q9.1(G) R34.2 ; port MCU_DIN_3
NetC9_2: C9.2 D3.2(K) Q4.1(G) R23.1 R26.2
NetC10_2: C10.2 D4.2(K) Q6.1(G) R24.2 R27.2
NetC11_2: C11.2 D5.2(K) Q8.1(G) R25.2 R28.2
NetD1_1: D1.1(A) R20.2 R23.2
NetD2_1: D2.1(A) R22.2 R25.1
NetD6_1: D6.1(A) R21.2 R24.1
NetLED3_1: LED3.1(A) R14.1
NetLED4_1: LED4.1(A) R15.1
NetLED5_1: LED5.1(A) R16.1
NetLED6_1: LED6.1(A) R29.1
NetLED7_1: LED7.1(A) R30.1
NetLED8_1: LED8.1(A) R31.1
NetQ1_1: Q1.1(G) R11.2 R17.1
NetQ2_1: Q2.1(G) R12.2 R18.1
NetQ3_1: Q3.1(G) R13.2 R19.1
NetQ4_2: Q4.2(D) Q5.1(G) R32.2 ; port MCU_DIN_1
NetQ5_2: Q5.2(D) R29.2
NetQ7_2: Q7.2(D) R30.2
NetQ9_2: Q9.2(D) R31.2
NetR17_2: R17.2 ; port MCU_DOUT_1
NetR18_2: R18.2 ; port MCU_DOUT_2
NetR19_2: R19.2 ; port MCU_DOUT_3

### Notes on the sheet
- Title:
- Project:
- Date:
- Author:
- Version:
- Sheet:
- of

### Library data of the parts
C9-C11 = Cap: Capacitor
D1-D6 = D Schottky: Schottky Diode; Published: 8-Jun-2000; LatestRevisionDate: 17-Jul-2002; LatestRevisionNote: Re-released for DXP Platform.; PackageReference: SMB; Publisher: Altium Limited; PackageDescription: DO-214-AA/SMB; 2 C-Bend Leads; Body 5.3 x 3.6 mm, inc. leads (LxW); Code_JEDEC: DO-214-AA
P3-P8 = Header 2: Header, 2-Pin; LatestRevisionDate: 17-Jul-2002; LatestRevisionNote: Re-released for DXP Platform.; Publisher: Altium Limited
Q1-Q9 = Transistor-PMOS: P-Channel MOSFET
R11-R34 = Res: Resistor
TZ3-TZ5 = TVZ-Unidirectional

## Sheet PowerSupplies.SchDoc: Power Supplies
size A4; Author: João Guimarães; Organization: Altium Limited; Address1: L3, 12a Rodborough Rd; Address2: Frenchs Forest; Address3: NSW; Address4: Australia 2086; Revision: 2.0; SheetNumber: 2; SheetTotal: 9
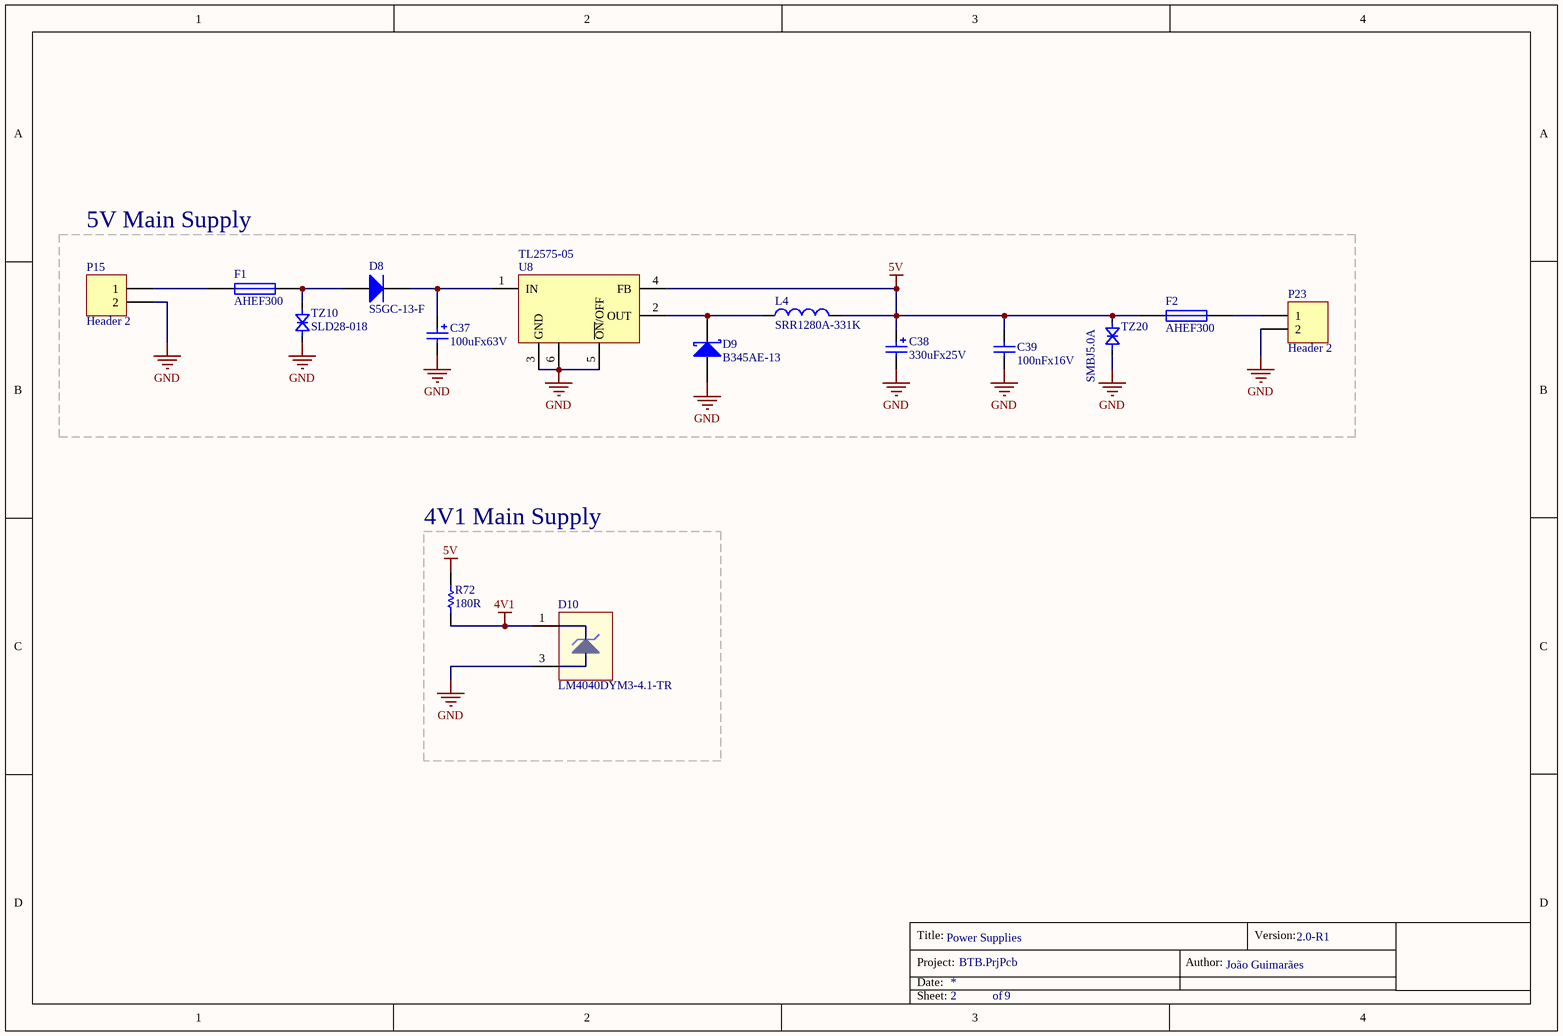
[diagram p8: PowerSupplies.SchDoc]

### Parts
C37  100uFx63V  [DISC-CAP-ALU-G]
C38  330uFx25V  [DISC-CAP-ALU-F]
C39  100nFx16V  [DISC-0805]
D8  S5GC-13-F  [DISC-DO214-AB]
D9  B345AE-13  [DISC-DO214-AC]
D10  LM4040DYM3-4.1-TR  [DISC-SOT-23]
F1  AHEF300  [DISC-PTC-0.2X0.4]
F2  AHEF300  [DISC-PTC-0.2X0.4]
L4  SRR1280A-331K  [DISC-IND-5050]
P15  Header 2  [CON-FLEXWIRE-1.5MM2-1X2]
P23  Header 2  [CON-FLEXWIRE-1.5MM2-1X2]
R72  180R  [DISC-0805]
TZ10  SLD28-018  [DISC-DIODE-0.9-V]
TZ20  SMBJ5.0A  [DISC-DO214-AA]
U8  TL2575-05  [CI-TO-263]

### Blocks framed on the sheet
5V Main Supply: C37-C39 D8 D9 F1 F2 L4 P15 P23 TZ10 TZ20 U8
4V1 Main Supply: D10 R72

### Nets
4V1: D10.1(A) R72.1
5V: C38.1 C39.2 F2.1 L4.2 R72.2 TZ20.2(K) U8.4(FB)
GND: C37.2 C38.2 C39.1 D9.1(A) D10.3(K) P15.2 P23.2 TZ10.1(A) TZ20.1(A) U8.3(GND) U8.5(~{ON}/OFF) U8.6(GND)
NetC37_1: C37.1 D8.2(K) U8.1(IN)
NetD8_1: D8.1(A) F1.2 TZ10.2(K)
NetD9_2: D9.2(K) L4.1 U8.2(OUT)
NetF1_1: F1.1 P15.1
NetF2_2: F2.2 P23.1

Not connected (* = marked no-connect by the designer): D10 2

### Notes on the sheet
- Title:
- Project:
- Date:
- Author:
- Version:
- Sheet:
- of

### Library data of the parts
C37 C38 = Cap Pol: Polarized Capacitor (Surface Mount)
C39 = Cap: Capacitor
D8 = Diode: Default Diode; Published: 8-Jun-2000; LatestRevisionDate: 17-Jul-2002; LatestRevisionNote: Re-released for DXP Platform.; PackageVersion: Sep-1996; PackageReference: SMC; Publisher: Altium Limited; PackageDescription: DO-214-AB/SMC; 2 C-Bend Leads; Body 7.9 x 5.9 mm, inc. leads (LxW); Code_JEDEC: DO-214-AB
D9 = D Schottky: Schottky Diode; Published: 8-Jun-2000; LatestRevisionDate: 17-Jul-2002; LatestRevisionNote: Re-released for DXP Platform.; PackageReference: SMB; Publisher: Altium Limited; PackageDescription: DO-214-AA/SMB; 2 C-Bend Leads; Body 5.3 x 3.6 mm, inc. leads (LxW); Code_JEDEC: DO-214-AA
D10 = LM4040: Shunt Voltage References
F1 F2 = Fuse 1: Fuse; Published: 8-Jun-2000; LatestRevisionDate: 17-Jul-2002; LatestRevisionNote: Re-released for DXP Platform.; PackageReference: PIN-W2/E2.8; Publisher: Altium Limited; PackageDescription: Thru-Hole; 2 Leads
L4 = Inductor: Chip Inductor
P15 P23 = Header 2: Header, 2-Pin; LatestRevisionDate: 17-Jul-2002; LatestRevisionNote: Re-released for DXP Platform.; Publisher: Altium Limited
R72 = Res: Resistor
TZ10 TZ20 = TVZ-Bi-Directional
U8 = TL2575-05IKTTR: Switching Voltage Regulators 1-A Step-Down Voltage

## Nets that join several sheets
4V1: TemperatureACQ (C53.2 C60.2 U11.4 U13.4), ForceACQ (C17.2 C23.2 U4.4 U6.4), PowerSupplies (D10.1 R72.1)
5V: SpeedACQ (8 pins), MCU (15 pins), TemperatureACQ (14 pins), ForceACQ (18 pins), VibrationACQ (P21.1 Q21.3 Q22.3), AnalogOutput (C1.2 C5.2 U1.5 U2.5), DigitalInterfaces (15 pins), PowerSupplies (7 pins)
GND: SpeedACQ (22 pins), MCU (26 pins), TemperatureACQ (30 pins), ForceACQ (38 pins), VibrationACQ (15 pins), AnalogOutput (16 pins), DigitalInterfaces (27 pins), PowerSupplies (12 pins)
ANALOG_OUT_1: MCU (U7.27), AnalogOutput (5 pins)
ANALOG_OUT_2: MCU (U7.28), AnalogOutput (5 pins)
LOAD_CON_1: MCU (U7.31), ForceACQ (Q11.1 R37.2 R42.1 U4.1)
LOAD_CON_2: MCU (U7.32), ForceACQ (Q13.1 R47.2 R52.1 U6.1)
LOAD_SIG_1: MCU (U7.39), ForceACQ (C16.2 R40.2 R41.1)
LOAD_SIG_2: MCU (U7.40), ForceACQ (C25.2 R50.1 R55.2)
MISO: MCU (P13.1 U7.11), DigitalInterfaces (Q6.2 Q7.1 R33.2)
MOSI: MCU (P13.4 U7.10), DigitalInterfaces (Q8.2 Q9.1 R34.2)
NetC43_2: SpeedACQ (C43.2 R74.2), MCU (U7.36)
NetP22_2: MCU (U7.41), VibrationACQ (P22.2 P22.4 P22.6)
NetQ4_2: MCU (U7.21), DigitalInterfaces (Q4.2 Q5.1 R32.2)
NetQ18_2: SpeedACQ (Q18.2 R84.1), MCU (U7.1)
NetQ21_2: MCU (U7.12), VibrationACQ (Q21.2 Q22.1 R114.2)
NetR2_2: MCU (U7.29), AnalogOutput (R2.2)
NetR8_2: MCU (U7.30), AnalogOutput (R8.2)
NetR17_2: MCU (U7.18), DigitalInterfaces (R17.2)
NetR18_2: MCU (U7.19), DigitalInterfaces (R18.2)
NetR19_2: MCU (U7.20), DigitalInterfaces (R19.2)
THERM_CON_1: MCU (U7.25), TemperatureACQ (Q19.1 R85.2 R91.1 U11.1)
THERM_CON_2: MCU (U7.26), TemperatureACQ (Q20.1 R95.2 R101.1 U13.1)
THERM_SIG_1: MCU (U7.37), TemperatureACQ (C52.2 R88.2 R89.1)
THERM_SIG_2: MCU (U7.38), TemperatureACQ (C59.2 R98.2 R99.1)

## Assembly variants
BoM: not fitted C9 C10 C11 C46 D1 D2 D3 D4 D5 D6 D7 D11 D13 F2 LED6 LED7 LED8 LED9 LED10 LED12 LED14 LED15 LED16 P6 P7 P8 P23 Q4 Q5 Q6 Q7 Q8 Q9 Q11 Q13 Q15 Q17 Q18 Q19 Q20 R20 R21 R22 R23 R24 R25 R26 R27 R28 R29 R30 R31 R32 R33 R34 R37 R38 R45 R46 R47 R49 R53 R58 R67 R70 R79 R81 R82 R83 R84 R85 R86 R93 R95 R96 R103 R115 TZ20